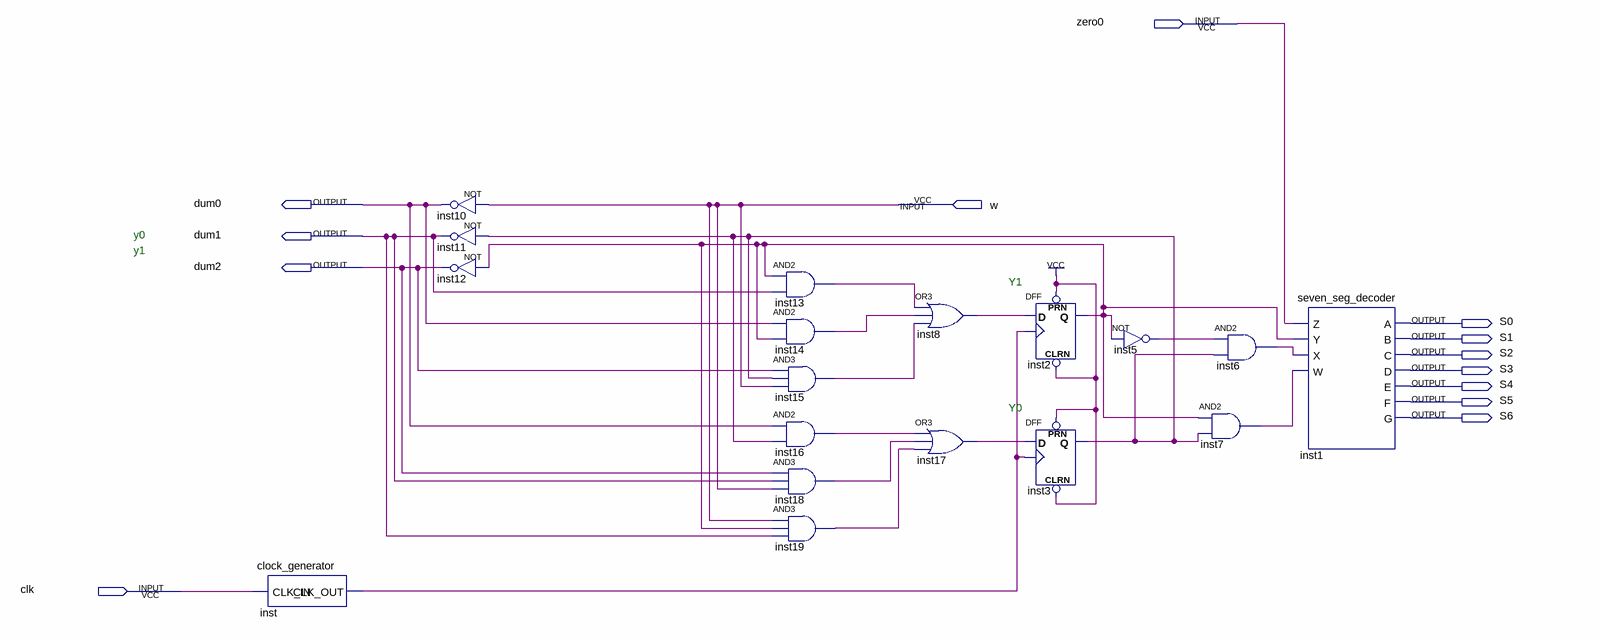
[diagram p0: schematic sheet]
// Quartus schematic lab11step2.bdf as structural Verilog: 18 symbols, 13 pins
module lab11step2 (
  input  zero0,
  input  w,
  input  clk,
  output dum0,
  output dum1,
  output dum2,
  output S0,
  output S1,
  output S2,
  output S3,
  output S4,
  output S5,
  output S6
);

  wire inst2_q, inst3_q, inst5_out, inst6_out, inst7_out, inst8_out, inst13_out, inst14_out, inst15_out,
       inst16_out, inst17_out, inst18_out, inst19_out, inst_clk_out;

  clock_generator inst (.CLK_IN(clk), .CLK_OUT(inst_clk_out));
  not inst10 (dum0, w);
  not inst11 (dum1, inst3_q);
  not inst12 (dum2, inst2_q);
  and inst13 (inst13_out, inst2_q, dum1);
  and inst14 (inst14_out, dum0, inst2_q);
  and inst15 (inst15_out, dum2, inst3_q, w);
  and inst16 (inst16_out, dum0, inst3_q);
  and inst18 (inst18_out, dum2, dum1, w);
  and inst19 (inst19_out, w, inst2_q, dum1);
  or inst8 (inst8_out, inst13_out, inst14_out, inst15_out);
  or inst17 (inst17_out, inst16_out, inst18_out, inst19_out);
  DFF inst2 (.CLRN(1'b1), .CLK(inst_clk_out), .D(inst8_out), .PRN(1'b1), .Q(inst2_q));
  DFF inst3 (.CLRN(1'b1), .CLK(inst_clk_out), .D(inst17_out), .PRN(1'b1), .Q(inst3_q));
  not inst5 (inst5_out, inst2_q);
  and inst6 (inst6_out, inst5_out, inst3_q);
  and inst7 (inst7_out, inst2_q, inst3_q);
  seven_seg_decoder inst1 (
    .Z(zero0), .Y(inst2_q), .X(inst6_out), .W(inst7_out), .A(S0), .B(S1), .C(S2), .D(S3), .E(S4), .F(S5),
    .G(S6));

  // Notes on the sheet:
  //   y0
  //   y1
  //   Y1
  //   Y0
endmodule
